# Altium schematic sheet Schematics.SchDoc
size A; SheetNumber: 1; SheetTotal: 1
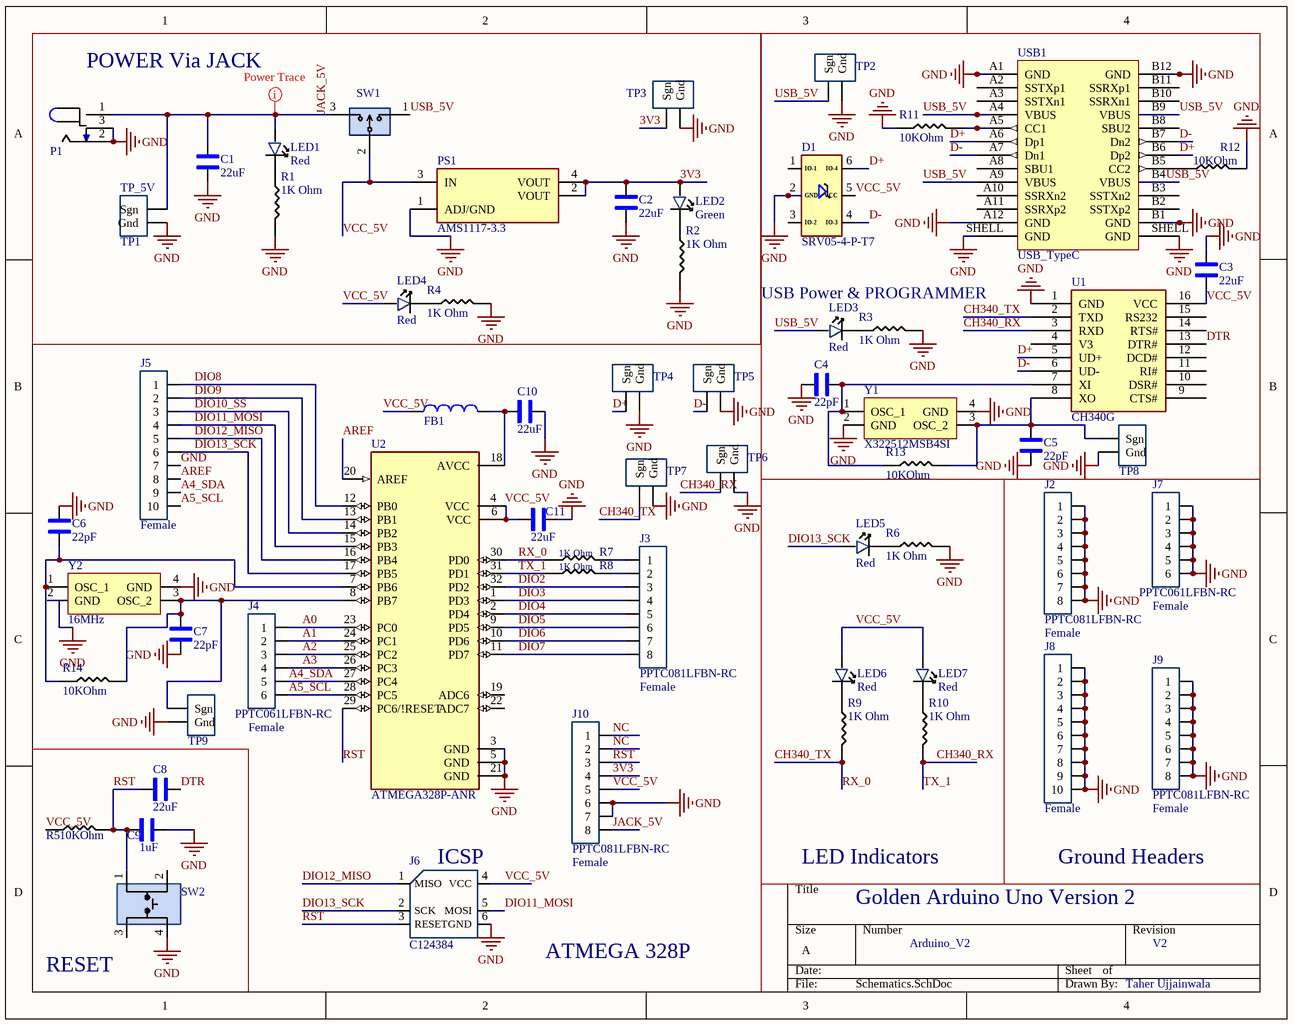
[diagram p0: Schematics.SchDoc]

## Parts
C1  22uF  [0805_Passive_Capaciitor]
C2  22uF  [0805_Passive_Capaciitor]
C3  22uF  [0805_Passive_Capaciitor]
C4  22pF  [0402_Passive_Capacitor]
C5  22pF  [0402_Passive_Capacitor]
C6  22pF  [0402_Passive_Capacitor]
C7  22pF  [0402_Passive_Capacitor]
C8  22uF  [0805_Passive_Capaciitor]
C9  1uF  [0402_Passive_Capacitor]
C10  22uF  [0805_Passive_Capaciitor]
C11  22uF  [0805_Passive_Capaciitor]
D1  SRV05-4-P-T7  [TVS]
FB1  FB_10uH_0603  [0603_PASSIVE_Capacitor]  (value not drawn)
J2  PPTC081LFBN-RC  value Female  [8_PIN_ARDUINO_100MIL]
J3  PPTC081LFBN-RC  value Female  [8_PIN_ARDUINO_100MIL]
J4  PPTC061LFBN-RC  value Female  [6_PIN_ARDUINO_100mil]
J5  value Female  [10_PIN_ARDUINO_100MIL]  (hidden comment: PPTC101LFBN-RC)
J6  LCSC Part#: C124384  [ICSP]  (hidden comment: NRPN032PAEN-RC)
J7  PPTC061LFBN-RC  value Female  [6_PIN_ARDUINO_100mil]
J8  value Female  [10_PIN_ARDUINO_100MIL]  (hidden comment: PPTC101LFBN-RC)
J9  PPTC081LFBN-RC  value Female  [8_PIN_ARDUINO_100MIL]
J10  PPTC081LFBN-RC  value Female  [8_PIN_ARDUINO_100MIL]
LED1  value Red  [LED_0603]  (hidden comment: KT-0603R)
LED2  value Green  [LED_0603]  (hidden comment: KT-0603R)
LED3  value Red  [LED_0603]  (hidden comment: KT-0603R)
LED4  value Red  [LED_0603]  (hidden comment: KT-0603R)
LED5  value Red  [LED_0603]  (hidden comment: KT-0603R)
LED6  value Red  [LED_0603]  (hidden comment: KT-0603R)
LED7  value Red  [LED_0603]  (hidden comment: KT-0603R)
P1  Power Jack  [Power_Jack]  (value not drawn)
PS1  AMS1117-3.3  [LDO]
R1  value 1K Ohm  [0805_Passive_Resistor]  (hidden comment: 1k)
R2  value 1K Ohm  [0805_Passive_Resistor]  (hidden comment: 1k)
R3  value 1K Ohm  [0402_Passive_Resistor]  (hidden comment: 1k)
R4  value 1K Ohm  [0402_Passive_Resistor]  (hidden comment: 1k)
R5  value 10KOhm  [0402_Passive_Resistor]  (hidden comment: 10k)
R6  value 1K Ohm  [0402_Passive_Resistor]  (hidden comment: 1k)
R7  value 1K Ohm  [0402_Passive_Resistor]  (hidden comment: 1k)
R8  value 1K Ohm  [0402_Passive_Resistor]  (hidden comment: 1k)
R9  value 1K Ohm  [0402_Passive_Resistor]  (hidden comment: 1k)
R10  value 1K Ohm  [0402_Passive_Resistor]  (hidden comment: 1k)
R11  value 10KOhm  [0402_Passive_Resistor]  (hidden comment: 10k)
R12  value 10KOhm  [0402_Passive_Resistor]  (hidden comment: 10k)
R13  value 10KOhm  [1206_Passive_Resitor]  (hidden comment: 10k)
R14  value 10KOhm  [1206_Passive_Resitor]  (hidden comment: 10k)
SW1  PREC003SAAN-RC  [3_PIN_100mil]  (value not drawn)
SW2  TL3305AF160QG  [Switch_JLC]  (value not drawn)
TP1  TP_5V  [TP10x_Probe]
TP2  10x Probe TP  [TP10x_Probe]  (value not drawn)
TP3  10x Probe TP  [TP10x_Probe]  (value not drawn)
TP4  10x Probe TP  [TP10x_Probe]  (value not drawn)
TP5  10x Probe TP  [TP10x_Probe]  (value not drawn)
TP6  10x Probe TP  [TP10x_Probe]  (value not drawn)
TP7  10x Probe TP  [TP10x_Probe]  (value not drawn)
TP8  10x Probe TP  [TP10x_Probe]  (value not drawn)
TP9  10x Probe TP  [TP10x_Probe]  (value not drawn)
U1  CH340G  [USB to serial]
U2  ATMEGA328P-ANR  [ATMega328P]
USB1  USB_TypeC  [TYPE-C-TH_USB31-TYPEC-33141-2FS]
Y1  X322512MSB4SI  [Crystal resonator]
Y2  value 16MHz  [Crystal resonator]  (hidden comment: X322516MLB4SI)

## Blocks framed on the sheet
POWER Via JACK: C1 C2 LED1 LED2 LED4 P1 PS1 R1 R2 R4 SW1 TP1 TP3
USB Power & PROGRAMMER: C3-C5 D1 LED3 R3 R11-R13 TP2 TP8 U1 USB1 Y1

## Nets
GND: C1.1 C2.1 C3.2 C4.1 C5.1 C6.2 C7.1 C9.2 C10.2 C11.2 D1.2(GND) J2.1 J2.2 J2.3 J2.4 J2.5 J2.6 J2.7 J2.8 J5.7 J6.6(GND) J7.1 J7.2 J7.3 J7.4 J7.5 J7.6 J8.1 J8.2 J8.3 J8.4 J8.5 J8.6 J8.7 J8.8 J8.9 J8.10 J9.1 J9.2 J9.3 J9.4 J9.5 J9.6 J9.7 J9.8 J10.6 J10.7 P1.2 P1.3 PS1.1(ADJ/GND) R1.2 R2.2 R3.2 R4.2 R6.2 R11.1 R12.2 SW2.4 TP1.2(Gnd) TP2.2(Gnd) TP3.2(Gnd) TP4.2(Gnd) TP5.2(Gnd) TP6.2(Gnd) TP7.2(Gnd) TP8.2(Gnd) TP9.2(Gnd) U1.1(GND) U2.3(GND) U2.5(GND) U2.21(GND) USB1.A1(GND) USB1.A12(GND) USB1.B1(GND) USB1.B12(GND) USB1.SHELL(GND) Y1.2(GND) Y1.4(GND) Y2.2(GND) Y2.4(GND)
3V3: C2.2 J10.4 LED2.1 PS1.2(VOUT) PS1.4(VOUT) TP3.1(Sgn)
A0: J4.1 U2.23(PC0)
A1: J4.2 U2.24(PC1)
A2: J4.3 U2.25(PC2)
A3: J4.4 U2.26(PC3)
A4_SDA: J4.5 J5.9 U2.27(PC4)
A5_SCL: J4.6 J5.10 U2.28(PC5)
AREF: J5.8 U2.20(AREF)
CH340_RX: R8.1 R10.2 TP6.1(Sgn) U1.3(RXD) U2.31(PD1)  [also labelled TX_1]
CH340_TX: R7.1 R9.2 TP7.1(Sgn) U1.2(TXD) U2.30(PD0)  [also labelled RX_0]
D+: D1.6(IO-4) TP4.1(Sgn) U1.5(UD+) USB1.A6(Dp1) USB1.B6(Dp2)
D-: D1.4(IO-3) TP5.1(Sgn) U1.6(UD-) USB1.A7(Dn1) USB1.B7(Dn2)
DIO2: J3.3 U2.32(PD2)
DIO3: J3.4 U2.1(PD3)
DIO4: J3.5 U2.2(PD4)
DIO5: J3.6 U2.9(PD5)
DIO6: J3.7 U2.10(PD6)
DIO7: J3.8 U2.11(PD7)
DIO8: J5.1 U2.12(PB0)
DIO9: J5.2 U2.13(PB1)
DIO10_SS: J5.3 U2.14(PB2)
DIO11_MOSI: J5.4 J6.5(MOSI) U2.15(PB3)
DIO12_MISO: J5.5 J6.1(MISO) U2.16(PB4)
DIO13_SCK: J5.6 J6.2(SCK) LED5.1 U2.17(PB5)
DTR: C8.2 U1.13(DTR#)
JACK_5V: C1.2 J10.8 LED1.1 P1.1 SW1.3 TP1.1(Sgn)
NC: J10.1 J10.2
RST: C8.1 C9.1 J6.3(RESET) J10.3 R5.2 SW2.1 U2.29(PC6/!RESET)
USB_5V: LED3.1 SW1.1 TP2.1(Sgn) USB1.A4(VBUS) USB1.A9(VBUS) USB1.B4(VBUS) USB1.B9(VBUS)
VCC_5V: C3.1 C11.1 D1.5(VCC) FB1.1 J6.4(VCC) J10.5 LED4.1 LED6.1 LED7.1 PS1.3(IN) R5.1 SW1.2 U1.16(VCC) U2.4(VCC) U2.6(VCC)
NetC4_2: C4.2 R13.1 U1.7(XI) Y1.1(OSC_1)
NetC5_2: C5.2 R13.2 TP8.1(Sgn) U1.8(XO) Y1.3(OSC_2)
NetC6_1: C6.1 R14.1 U2.7(PB6) Y2.1(OSC_1)
NetC7_2: C7.2 R14.2 TP9.1(Sgn) U2.8(PB7) Y2.3(OSC_2)
NetC10_1: C10.1 FB1.2 U2.18(AVCC)
NetJ3_1: J3.1 R7.2
NetJ3_2: J3.2 R8.2
NetLED1_2: LED1.2 R1.1
NetLED2_2: LED2.2 R2.1
NetLED3_2: LED3.2 R3.1
NetLED4_2: LED4.2 R4.1
NetLED5_2: LED5.2 R6.1
NetLED6_2: LED6.2 R9.1
NetLED7_2: LED7.2 R10.1
NetR11_2: R11.2 USB1.A5(CC1)
NetR12_1: R12.1 USB1.B5(CC2)

Not connected (* = marked no-connect by the designer): D1 1(IO-1) 3(IO-2); SW2 2 3; U1 4(V3) 9(CTS#) 10(DSR#) 11(RI#) 12(DCD#) 14(RTS#) 15(RS232); U2 19(ADC6) 22(ADC7); USB1 A2(SSTXp1) A3(SSTXn1) A8(SBU1) A10(SSRXn2) A11(SSRXp2) B2(SSTXp2) B3(SSTXn2) B8(SBU2) B10(SSRXn1) B11(SSRXp1)

## Layout directives
mark named Power Trace: JACK_5V

## Notes on the sheet
- (near J6) ICSP
- LED Indicators
- Golden Arduino Uno Version 2
- Ground Headers
- (near SW2) RESET
- ATMEGA 328P
- Arduino_V2
- V2
- Taher Ujjainwala

## Library data of the parts
C1-C3 C8 C10 C11 = C_22uF_0805: MULTILAYER CERAMIC CAPACITORS MLCC - SMD/SMT 22UF 25V 0805 ROHS; MFR Part #: CL21A226MAQNNNE; Type: Basic; Datasheet: https://datasheet.lcsc.com/szlcsc/Samsung-Electro-Mechanics-CL21A226MAQNNNE_C45783.pdf; LCSC Part#: C45783; Value: 22uF
C4-C7 = C_22pF_0402: MULTILAYER CERAMIC CAPACITORS MLCC - SMD/SMT 22PF 50V 0402 ROHS; MFR Part #: 0402CG220J500NT; Type: Basic; Datasheet: https://datasheet.lcsc.com/szlcsc/Guangdong-Fenghua-Advanced-Tech-0402CG220J500NT_C1555.pdf; LCSC Part#: C1555; Value: 22pF
C9 = C_1uF_0402: MULTILAYER CERAMIC CAPACITORS MLCC - SMD/SMT 1UF 25V 0402 ROHS; MFR Part #: CL05A105KA5NQNC; Type: Basic; Datasheet: https://datasheet.lcsc.com/szlcsc/Samsung-Electro-Mechanics-CL05A105KA5NQNC_C52923.pdf; LCSC Part#: C52923; Value: 1uF
D1 = D_TVS_Diode: TVS SOT-23-6 ROHS; Value: TVS DIODE 5.5V 6TSOP; Type: Basic; MFR Part #: SRV05-4-P-T7; LCSC Part#: C85364; Datasheet: https://datasheet.lcsc.com/szlcsc/ProTek-Devices-SRV05-4-P-T7_C85364.pdf
FB1 = FB_10uH_0603: 10 uH, 30 Q, 1.85 Ohm Series Resistance, 17MHz Self Resonant Frequency,Inductor , SMD 0603, 3 Amps rated current; MFR Part #: SDFL1608S100KTF; Type: Basic; Datasheet: https://datasheet.lcsc.com/szlcsc/Sunlord-SDFL1608S100KTF_C1035.pdf; LCSC Part#: C1035
J2 J3 J9 J10 = JF_8_PIN_FEMALE_ARDUINO: 8 Position Header Connector 0.100" (2.54mm) Through Hole Tin; Digikey Link: https://www.digikey.com/product-detail/en/PPTC081LFBN-RC/S7006-ND/810147/?itemSeq=304982354; Digikey Part: S7006-ND; Type: Extended; LCSC Part#: C27438
J4 J7 = JF_6_PIN_FEMALE_ARDUINO: 6 Position Header Connector 0.100" (2.54mm) Through Hole Tin; Digikey Link: https://www.digikey.com/product-detail/en/PPTC061LFBN-RC/S7004-ND/810145/?itemSeq=304982353; Digikey Part: S7004-ND; LCSC Part#: C40877; Type: Extended
J5 J8 = JF_10_PIN_FEMALE_ARDUINO: 10 Position Header Connector 0.100" (2.54mm) Through Hole Tin; Digikey Link: https://www.digikey.com/product-detail/en/PPTC101LFBN-RC/S7008-ND/810149/?itemSeq=304982352; Digikey Part: S7008-ND; LCSC Part#: C225507; Type: Extended
J6 = J_ICSP: Connector Header Through Hole 6 position 0.079" (2.00mm); Digikey Link: https://www.digikey.com/product-detail/en/NRPN032PAEN-RC/S5801-03-ND/804955/?itemSeq=304982355; Digikey Part: S5801-03-ND; Value: NRPN032PAEN-RC; Type: Extended
LED1 LED3-LED7 = LED_RED_0603: LIGHT EMITTING DIODES (LED) RED 520~625NM 90~100MCD@20MA TOP VIEW 0603 ROHS; Type: Basic; Datasheet: https://datasheet.lcsc.com/szlcsc/Everlight-Elec-19-217-BHC-ZL1M2RY-3T_C72041.pdf; MFR Part #: KT-0603R; LCSC Part#: C2286
LED2 = LED_GREEN_0603: LIGHT EMITTING DIODES (LED) GREEN 520~535NM 112~258MCD@20MA TOP VIEW 0603 ROHS; MFR Part #: 19-217/GHC-YR1S2/3T; Type: Basic; LCSC Part#: C72043
P1 = P_Power Jack: Power Barrel Connector Jack 2.10mm ID (0.083"), 5.50mm OD (0.217") Through Hole, Right Angle; Value: CONN PWR JACK 2X5.5MM SOLDER; Digikey Link: https://www.digikey.com/product-detail/en/PJ-102A/CP-102A-ND/275425/?itemSeq=304982367; Digikey Part: CP-102A-ND; LCSC Part#: C136744; Type: Extended
PS1 = PS_AMS_LDO_3v3: LOW DROPOUT REGULATORS(LDO) POSITIVE FIXED 1.3V @ 800MA 15V 3.3V 1A SOT-223 ROHS; Value: IC REG LINEAR 3.3V 800MA SOT223; MFR Part #: AMS1117-3.3; LCSC Part#: C6186; Type: Basic
R1 R2 = R_1K_0805: CHIP RESISTOR - SURFACE MOUNT 1KOHMS ±1% 1/8W 0805 ROHS; MFR Part #: 0805W8F1001T5E; LCSC Part#: C17513; Type: Basic
R3 R4 R6-R10 = R_1K_0402: 1 kOhms chip resistor SURFACE MOUNT 1KOHMS ±1% 1/16W 0402 ROHS; MFR Part #: 0402WGF1001TCE; Datasheet: https://datasheet.lcsc.com/szlcsc/Uniroyal-Elec-0402WGF1001TCE_C11702.pdf; LCSC Part#: C11702; Type: Basic
R5 R11 R12 = R_10KOhm_0402: CHIP RESISTOR - SURFACE MOUNT 10KOHMS ±1% 1/16W 0402 ROHS; MFR Part #: 0402WGF1002TCE; Datasheet: https://datasheet.lcsc.com/szlcsc/Uniroyal-Elec-0402WGF1002TCE_C25744.pdf; LCSC Part#: C25744; Type: Basic
R13 R14 = R_10KOhm_1206: 10 kOhms ±5% 0.25W, 1/4W Chip Resistor 1206 (3216 Metric) Automotive AEC-Q200 Thick Film; Digikey Link: https://www.digikey.com/product-detail/en/RMCF1206JT300R/RMCF1206JT300RCT-ND/1942776/?itemSeq=304982374; Digikey Part: RMCF1206JT300RCT-ND; LCSC Part#: C17902; Type: Basic
SW1 = SW_3Pin_100mil_Switch: Connector Header Through Hole 3 position 0.100" (2.54mm); Value: CONN HEADER VERT 3POS 2.54MM; Digikey Link: https://www.digikey.com/product-detail/en/PREC003SAAN-RC/S1012EC-03-ND/2774851/?itemSeq=304982371; Digikey Part: S1012EC-03-ND; Type: Extended; LCSC Part#: C429954
SW2 = SW_Push_Button_JLC: Tactile Switch SPST-NO Top Actuated Surface Mount; MFR Part #: C174049; LCSC Part#: C174049; Type: Extended
TP1-TP9 = TP_10x_Probe: Test Point 300 mil centers
U1 = U_USBtoSerial: Transceiver USB 2.0 2Mbps SOP-16_150mil USB ICs RoHS; Datasheet: https://datasheet.lcsc.com/lcsc/2008191806_WCH-Jiangsu-Qin-Heng-CH340G_C14267.pdf; LCSC Part#: C14267; MFR Part #: CH340G; Type: Basic; Value: USB to Serial
U2 = U_ATMega328P: AVR AVR® ATmega Microcontroller IC 8-Bit 20MHz 32KB (16K x 16) FLASH 32-TQFP (7x7); MFR Part #: ATMEGA328P-AU; Value: IC MCU 8BIT 32KB FLASH 32TQFP; Digikey Link: https://www.digikey.com/product-detail/en/ATMEGA328P-ANR/ATMEGA328P-ANRCT-ND/2774230/?itemSeq=304982365; LCSC Part#: C14877; Type: Basic
USB1 = USB_TypeC3.1
Y1 = X_12MHz_Res: SMD Crystal Resonators 12MHz ±10ppm SMD-3225_4P RoHS; LCSC Part#: C9002; MFR Part #: X322512MSB4SI; Value: 12MHz; Type: Basic; Datasheet: https://datasheet.lcsc.com/szlcsc/Yangxing-Tech-X322512MSB4SI_C9002.pdf
Y2 = X_16Mhz_Res: ±10ppm 16000000Hz -40℃~85℃ 贴片无源晶振 60Ω 9pF SMD3225-4P Crystals ROHS; LCSC Part#: C13738; MFR Part #: X322516MLB4SI; Type: Basic